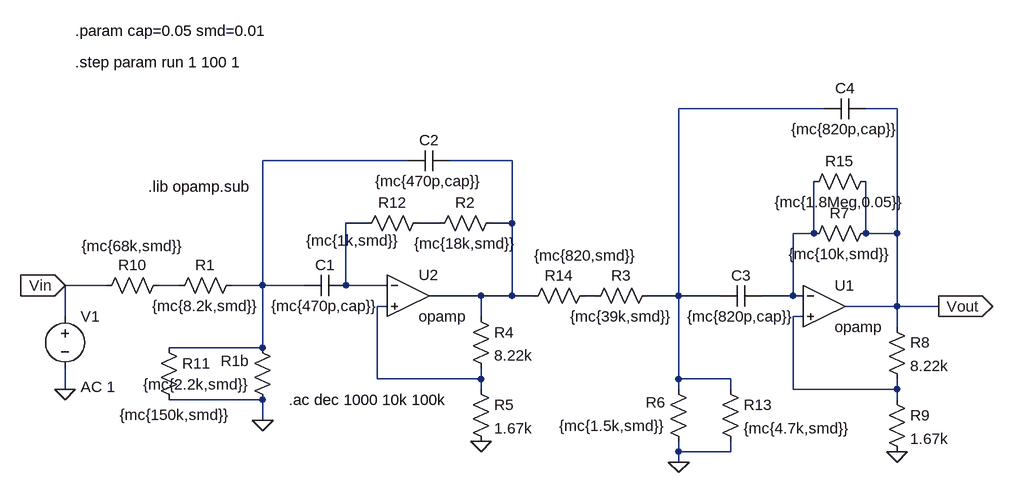
[diagram p0: schematic rauch_build.asc]
rauch_build.asc, the LTspice schematic file:
Version 4
SHEET 1 1440 680
WIRE 1088 -112 864 -112
WIRE 1200 -112 1152 -112
WIRE 448 -32 224 -32
WIRE 608 -32 512 -32
WIRE 384 64 352 64
WIRE 496 64 464 64
WIRE 608 64 608 -32
WIRE 608 64 576 64
WIRE 1072 80 1072 0
WIRE 1072 80 1040 80
WIRE 1152 80 1152 0
WIRE 1200 80 1200 -112
WIRE 1200 80 1152 80
WIRE -16 160 -80 160
WIRE 96 160 64 160
WIRE 224 160 224 -32
WIRE 224 160 176 160
WIRE 288 160 224 160
WIRE 352 160 352 64
WIRE 416 160 352 160
WIRE 560 176 480 176
WIRE 608 176 608 64
WIRE 608 176 560 176
WIRE 640 176 608 176
WIRE 736 176 720 176
WIRE 864 176 864 -112
WIRE 864 176 816 176
WIRE 928 176 864 176
WIRE 1040 176 1040 80
WIRE 1040 176 992 176
WIRE 1056 176 1040 176
WIRE 416 192 400 192
WIRE 1200 192 1200 80
WIRE 1200 192 1120 192
WIRE 1264 192 1200 192
WIRE -80 208 -80 160
WIRE 560 208 560 176
WIRE 1056 208 1040 208
WIRE 1200 224 1200 192
WIRE 224 256 224 160
WIRE 224 256 80 256
WIRE 400 304 400 192
WIRE 560 304 560 288
WIRE 560 304 400 304
WIRE 864 304 864 176
WIRE 944 304 864 304
WIRE -80 320 -80 288
WIRE 560 320 560 304
WIRE 864 320 864 304
WIRE 944 320 944 304
WIRE 1040 320 1040 208
WIRE 1200 320 1200 304
WIRE 1200 320 1040 320
WIRE 224 336 80 336
WIRE 1200 336 1200 320
WIRE 224 368 224 336
WIRE 864 416 864 400
WIRE 944 416 944 400
WIRE 944 416 864 416
WIRE 864 432 864 416
FLAG 224 368 0
FLAG 560 400 0
FLAG -80 320 0
FLAG -80 160 Vin
IOPIN -80 160 In
FLAG 864 432 0
FLAG 1264 192 Vout
IOPIN 1264 192 Out
FLAG 1200 416 0
SYMBOL res 192 144 R90
WINDOW 0 0 56 VBottom 2
WINDOW 3 32 56 VTop 2
SYMATTR InstName R1
SYMATTR Value {mc{8.2k,smd}}
SYMBOL res 240 352 R180
WINDOW 0 36 76 Left 2
WINDOW 3 36 40 Left 2
SYMATTR InstName R1b
SYMATTR Value {mc{2.2k,smd}}
SYMBOL res 592 48 R90
WINDOW 0 0 56 VBottom 2
WINDOW 3 32 56 VTop 2
SYMATTR InstName R2
SYMATTR Value {mc{18k,smd}}
SYMBOL res 544 192 R0
SYMATTR InstName R4
SYMATTR Value 8.22k
SYMBOL res 544 304 R0
SYMATTR InstName R5
SYMATTR Value 1.67k
SYMBOL cap 352 144 R90
WINDOW 0 0 32 VBottom 2
WINDOW 3 32 32 VTop 2
SYMATTR InstName C1
SYMATTR Value {mc{470p,cap}}
SYMBOL cap 512 -48 R90
WINDOW 0 0 32 VBottom 2
WINDOW 3 32 32 VTop 2
SYMATTR InstName C2
SYMATTR Value {mc{470p,cap}}
SYMBOL Opamps\\opamp 448 112 R0
SYMATTR InstName U2
SYMBOL voltage -80 192 R0
WINDOW 123 24 124 Left 2
WINDOW 39 0 0 Left 0
SYMATTR Value2 AC 1
SYMATTR InstName V1
SYMATTR Value ""
SYMBOL res 832 160 R90
WINDOW 0 0 56 VBottom 2
WINDOW 3 32 56 VTop 2
SYMATTR InstName R3
SYMATTR Value {mc{39k,smd}}
SYMBOL res 880 416 R180
WINDOW 0 36 76 Left 2
WINDOW 3 36 40 Left 2
SYMATTR InstName R6
SYMATTR Value {mc{1.5k,smd}}
SYMBOL res 1168 64 R90
WINDOW 0 0 56 VBottom 2
WINDOW 3 32 56 VTop 2
SYMATTR InstName R7
SYMATTR Value {mc{10k,smd}}
SYMBOL res 1184 208 R0
SYMATTR InstName R8
SYMATTR Value 8.22k
SYMBOL res 1184 320 R0
SYMATTR InstName R9
SYMATTR Value 1.67k
SYMBOL cap 992 160 R90
WINDOW 0 0 32 VBottom 2
WINDOW 3 32 32 VTop 2
SYMATTR InstName C3
SYMATTR Value {mc{820p,cap}}
SYMBOL cap 1152 -128 R90
WINDOW 0 0 32 VBottom 2
WINDOW 3 32 32 VTop 2
SYMATTR InstName C4
SYMATTR Value {mc{820p,cap}}
SYMBOL Opamps\\opamp 1088 128 R0
SYMATTR InstName U1
SYMBOL res 80 144 R90
WINDOW 0 0 56 VBottom 2
WINDOW 3 -60 56 VTop 2
SYMATTR InstName R10
SYMATTR Value {mc{68k,smd}}
SYMBOL res 64 240 R0
WINDOW 3 -60 119 Left 2
SYMATTR Value {mc{150k,smd}}
SYMATTR InstName R11
SYMBOL res 480 48 R90
WINDOW 0 0 56 VBottom 2
WINDOW 3 27 117 VTop 2
SYMATTR InstName R12
SYMATTR Value {mc{1k,smd}}
SYMBOL res 928 304 R0
SYMATTR InstName R13
SYMATTR Value {mc{4.7k,smd}}
SYMBOL res 736 160 R90
WINDOW 0 0 56 VBottom 2
WINDOW 3 -62 15 VTop 2
SYMATTR InstName R14
SYMATTR Value {mc{820,smd}}
SYMBOL res 1168 -16 R90
WINDOW 0 0 56 VBottom 2
WINDOW 3 32 56 VTop 2
SYMATTR InstName R15
SYMATTR Value {mc{1.8Meg,0.05}}
TEXT 264 336 Left 2 !.ac dec 1000 10k 100k
TEXT 48 8 Left 2 !.lib opamp.sub
TEXT -64 -232 Left 2 !.param cap=0.05 smd=0.01
TEXT -64 -184 Left 2 !.step param run 1 100 1

The netlist it stands for:
* rauch_build.asc
R1 N002 N007 {mc{8.2k,smd}}
R1b 0 N002 {mc{2.2k,smd}}
R2 N003 N005 {mc{18k,smd}}
R4 N003 N009 8.22k
R5 N009 0 1.67k
C1 N004 N002 {mc{470p,cap}}
C2 N003 N002 {mc{470p,cap}}
XU2 N004 N009 N003 opamp Aol=100K GBW=10Meg  ; pins invin noninvin out
V1 Vin 0 AC 1
R3 N001 N008 {mc{39k,smd}}
R6 0 N001 {mc{1.5k,smd}}
R7 Vout N006 {mc{10k,smd}}
R8 Vout N010 8.22k
R9 N010 0 1.67k
C3 N006 N001 {mc{820p,cap}}
C4 Vout N001 {mc{820p,cap}}
XU1 N006 N010 Vout opamp Aol=100K GBW=10Meg  ; pins invin noninvin out
R10 N007 Vin {mc{68k,smd}}
R11 N002 0 {mc{150k,smd}}
R12 N005 N004 {mc{1k,smd}}
R13 N001 0 {mc{4.7k,smd}}
R14 N008 N003 {mc{820,smd}}
R15 Vout N006 {mc{1.8Meg,0.05}}
.ac dec 1000 10k 100k
.lib opamp.sub
.param cap=0.05 smd=0.01
.step param run 1 100 1
.backanno
.end